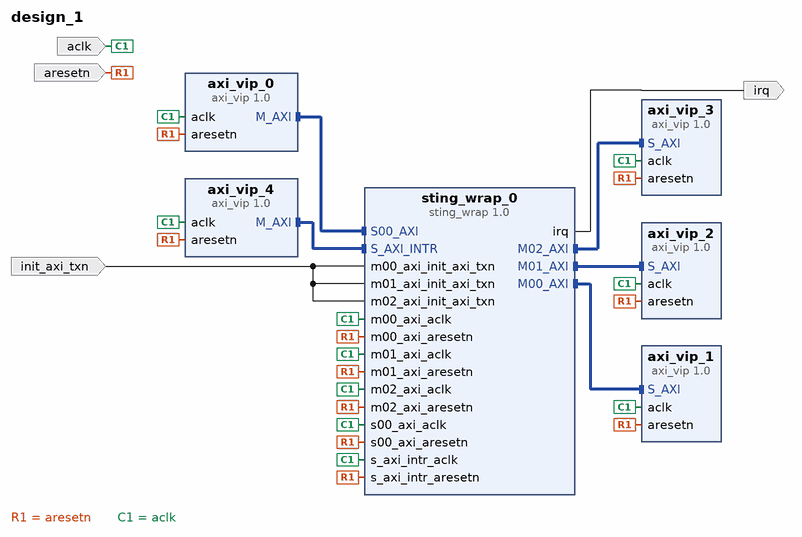
[diagram p0: block diagram of the top level]
# Vivado block design design_1, xc7z010clg400-1, Vivado 2017.2
create_bd_design design_1

create_bd_port -dir I -type rst aresetn
create_bd_port -dir I -type clk aclk
create_bd_port -dir O irq
create_bd_port -dir I init_axi_txn

create_bd_cell -type ip -vlnv xilinx.com:user:sting_wrap:1.0 sting_wrap_0
create_bd_cell -type ip -vlnv xilinx.com:ip:axi_vip:1.0 axi_vip_0
set_property -dict [list \
  CONFIG.PROTOCOL AXI4LITE \
  CONFIG.READ_WRITE_MODE READ_WRITE \
  CONFIG.INTERFACE_MODE MASTER \
  CONFIG.ADDR_WIDTH 32 \
  CONFIG.DATA_WIDTH 32 \
  CONFIG.WUSER_BITS_PER_BYTE 0 \
  CONFIG.RUSER_BITS_PER_BYTE 0 \
  CONFIG.HAS_PROT 1 \
  CONFIG.HAS_WSTRB 1 \
  CONFIG.HAS_BRESP 1 \
  CONFIG.HAS_RRESP 1 \
] [get_bd_cells axi_vip_0]
create_bd_cell -type ip -vlnv xilinx.com:ip:axi_vip:1.0 axi_vip_1
set_property -dict {CONFIG.INTERFACE_MODE SLAVE} [get_bd_cells axi_vip_1]
create_bd_cell -type ip -vlnv xilinx.com:ip:axi_vip:1.0 axi_vip_2
set_property -dict {CONFIG.PROTOCOL AXI4LITE CONFIG.INTERFACE_MODE SLAVE} [get_bd_cells axi_vip_2]
create_bd_cell -type ip -vlnv xilinx.com:ip:axi_vip:1.0 axi_vip_3
set_property -dict {CONFIG.INTERFACE_MODE SLAVE} [get_bd_cells axi_vip_3]
create_bd_cell -type ip -vlnv xilinx.com:ip:axi_vip:1.0 axi_vip_4
set_property -dict [list \
  CONFIG.PROTOCOL AXI4LITE \
  CONFIG.READ_WRITE_MODE READ_WRITE \
  CONFIG.INTERFACE_MODE MASTER \
  CONFIG.ADDR_WIDTH 32 \
  CONFIG.DATA_WIDTH 32 \
  CONFIG.WUSER_BITS_PER_BYTE 0 \
  CONFIG.RUSER_BITS_PER_BYTE 0 \
  CONFIG.HAS_PROT 1 \
  CONFIG.HAS_WSTRB 1 \
  CONFIG.HAS_BRESP 1 \
  CONFIG.HAS_RRESP 1 \
] [get_bd_cells axi_vip_4]

# ---- connections ----

connect_bd_intf_net [get_bd_intf_pins axi_vip_0/M_AXI] [get_bd_intf_pins sting_wrap_0/S00_AXI]
connect_bd_intf_net [get_bd_intf_pins sting_wrap_0/M00_AXI] [get_bd_intf_pins axi_vip_1/S_AXI]
connect_bd_intf_net [get_bd_intf_pins sting_wrap_0/M01_AXI] [get_bd_intf_pins axi_vip_2/S_AXI]
connect_bd_intf_net [get_bd_intf_pins sting_wrap_0/M02_AXI] [get_bd_intf_pins axi_vip_3/S_AXI]
connect_bd_intf_net [get_bd_intf_pins sting_wrap_0/S_AXI_INTR] [get_bd_intf_pins axi_vip_4/M_AXI]
connect_bd_net [get_bd_ports aresetn] \
  [get_bd_pins axi_vip_0/aresetn] [get_bd_pins axi_vip_1/aresetn] [get_bd_pins axi_vip_2/aresetn] \
  [get_bd_pins axi_vip_3/aresetn] [get_bd_pins sting_wrap_0/s_axi_intr_aresetn] [get_bd_pins sting_wrap_0/m00_axi_aresetn] \
  [get_bd_pins sting_wrap_0/s00_axi_aresetn] [get_bd_pins sting_wrap_0/m02_axi_aresetn] \
  [get_bd_pins sting_wrap_0/m01_axi_aresetn] [get_bd_pins axi_vip_4/aresetn]
connect_bd_net [get_bd_ports aclk] \
  [get_bd_pins axi_vip_0/aclk] [get_bd_pins axi_vip_1/aclk] [get_bd_pins axi_vip_2/aclk] [get_bd_pins axi_vip_3/aclk] \
  [get_bd_pins sting_wrap_0/s_axi_intr_aclk] [get_bd_pins sting_wrap_0/m00_axi_aclk] [get_bd_pins sting_wrap_0/s00_axi_aclk] \
  [get_bd_pins sting_wrap_0/m02_axi_aclk] [get_bd_pins sting_wrap_0/m01_axi_aclk] [get_bd_pins axi_vip_4/aclk]
connect_bd_net [get_bd_pins sting_wrap_0/irq] [get_bd_ports irq]
connect_bd_net [get_bd_ports init_axi_txn] \
  [get_bd_pins sting_wrap_0/m01_axi_init_axi_txn] [get_bd_pins sting_wrap_0/m02_axi_init_axi_txn] \
  [get_bd_pins sting_wrap_0/m00_axi_init_axi_txn]

# ---- address map ----
assign_bd_address -offset 0x34A00000 -range 64K -target_address_space [get_bd_addr_spaces axi_vip_0/Master_AXI] [get_bd_addr_segs sting_wrap_0/S00_AXI/S00_AXI_reg]
assign_bd_address -offset 0x34A00000 -range 64K -target_address_space [get_bd_addr_spaces axi_vip_4/Master_AXI] [get_bd_addr_segs sting_wrap_0/S_AXI_INTR/S_AXI_INTR_reg]
assign_bd_address -offset 0x40000000 -range 256M -target_address_space [get_bd_addr_spaces sting_wrap_0/M00_AXI] [get_bd_addr_segs axi_vip_1/S_AXI/Reg]
assign_bd_address -offset 0x60000000 -range 256M -target_address_space [get_bd_addr_spaces sting_wrap_0/M01_AXI] [get_bd_addr_segs axi_vip_2/S_AXI/Reg]
assign_bd_address -offset 0x50000000 -range 256M -target_address_space [get_bd_addr_spaces sting_wrap_0/M02_AXI] [get_bd_addr_segs axi_vip_3/S_AXI/Reg]

validate_bd_design
save_bd_design
